# EasyEDA Pro project 哨兵滑环分电板.eprj

# Schematic Schematic1
Board Name: Board1; Create Date: 2026-02-23; Page Name: P1; Project Name: 哨兵滑环分电板; Schematic Name: Schematic1; Update Date: 2026-02-23; Company: 嘉立创EDA; Page Size: A4; Version: V1.0
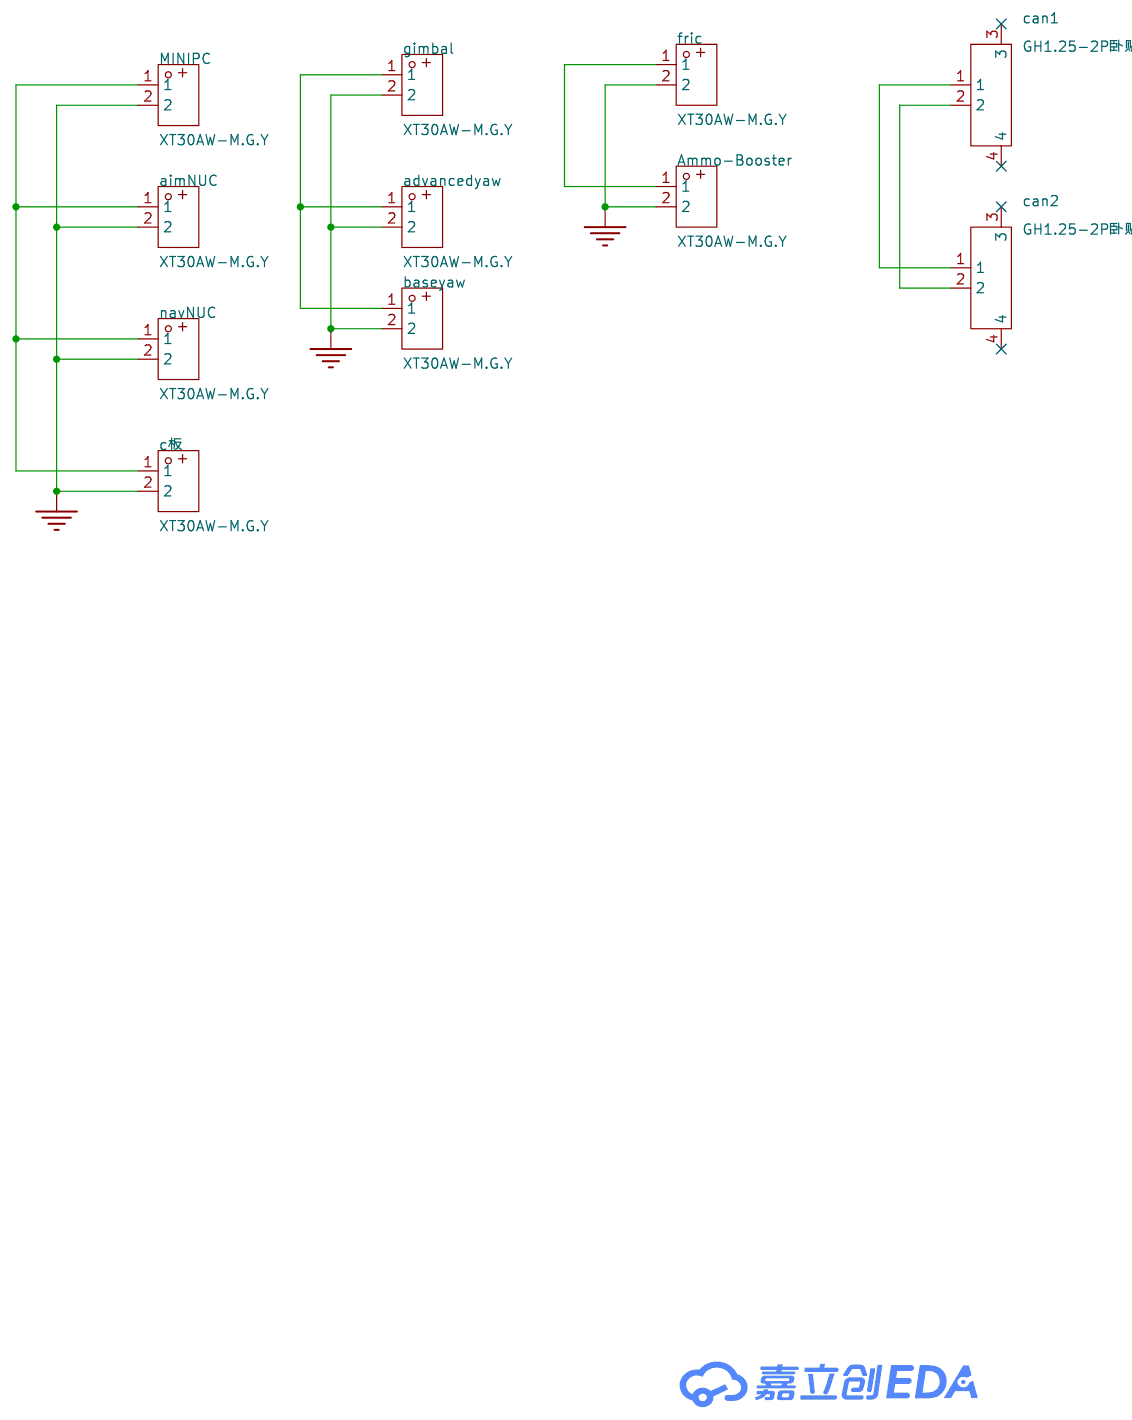
[diagram p0: schematic sheet]

## Parts
advancedyaw  XT30AW-M.G.Y  [CONN-TH_XT30AW-M.G.Y]
aimNUC  XT30AW-M.G.Y  [CONN-TH_XT30AW-M.G.Y]
Ammo-Booster  XT30AW-M.G.Y  [CONN-TH_XT30AW-M.G.Y]
baseyaw  XT30AW-M.G.Y  [CONN-TH_XT30AW-M.G.Y]
can1  GH1.25-2P卧贴  [CONN-SMD_2P-P1.25_X1251WRS-02HF-LPSW]
can2  GH1.25-2P卧贴  [CONN-SMD_2P-P1.25_X1251WRS-02HF-LPSW]
c板  XT30AW-M.G.Y  [CONN-TH_XT30AW-M.G.Y]
fric  XT30AW-M.G.Y  [CONN-TH_XT30AW-M.G.Y]
gimbal  XT30AW-M.G.Y  [CONN-TH_XT30AW-M.G.Y]
MINIPC  XT30AW-M.G.Y  [CONN-TH_XT30AW-M.G.Y]
navNUC  XT30AW-M.G.Y  [CONN-TH_XT30AW-M.G.Y]

## Library data of the parts
advancedyaw aimNUC Ammo-Booster baseyaw c板 fric gimbal MINIPC navNUC = XT30AW-M.G.Y: LCSC Part Name: XT30AW防水锁扣镀金15A二芯公插头; Supplier Part: C19268026; Manufacturer: AMASS(艾迈斯); JLCPCB Part Class: 扩展库; Datasheet: https://item.szlcsc.com/datasheet/XT30AW-M.G.Y/20526037.html; Supplier: LCSC
can1 can2 = GH1.25-2P卧贴_C9900015099: Supplier Part: C9900015099; JLCPCB Part Class: 扩展库; Supplier: LCSC

## Nets
GND: advancedyaw.2 aimNUC.2 Ammo-Booster.2 baseyaw.2 c板.2 fric.2 gimbal.2 MINIPC.2 navNUC.2
$1N339: aimNUC.1 c板.1 MINIPC.1 navNUC.1
$1N534: advancedyaw.1 baseyaw.1 gimbal.1
$1N591: Ammo-Booster.1 fric.1
$1N610: can1.1 can2.1
$1N616: can1.2 can2.2

Not connected (* = marked no-connect by the designer): can1 3* 4*; can2 3* 4*

# Board PCB1
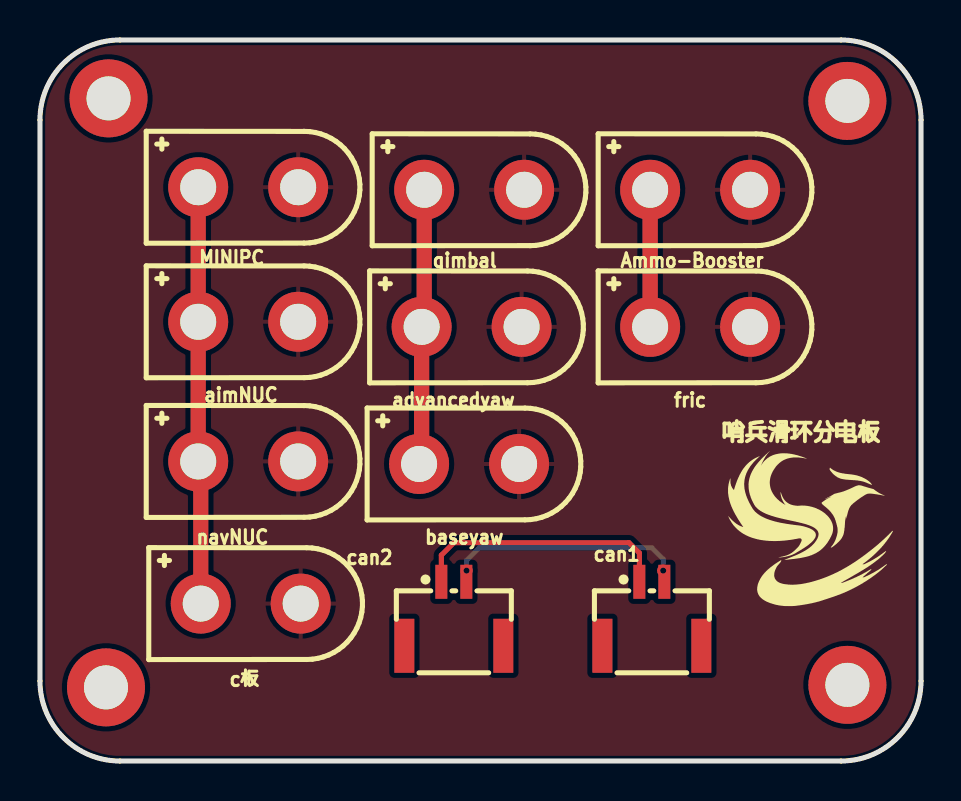
[diagram p1: board, top side]
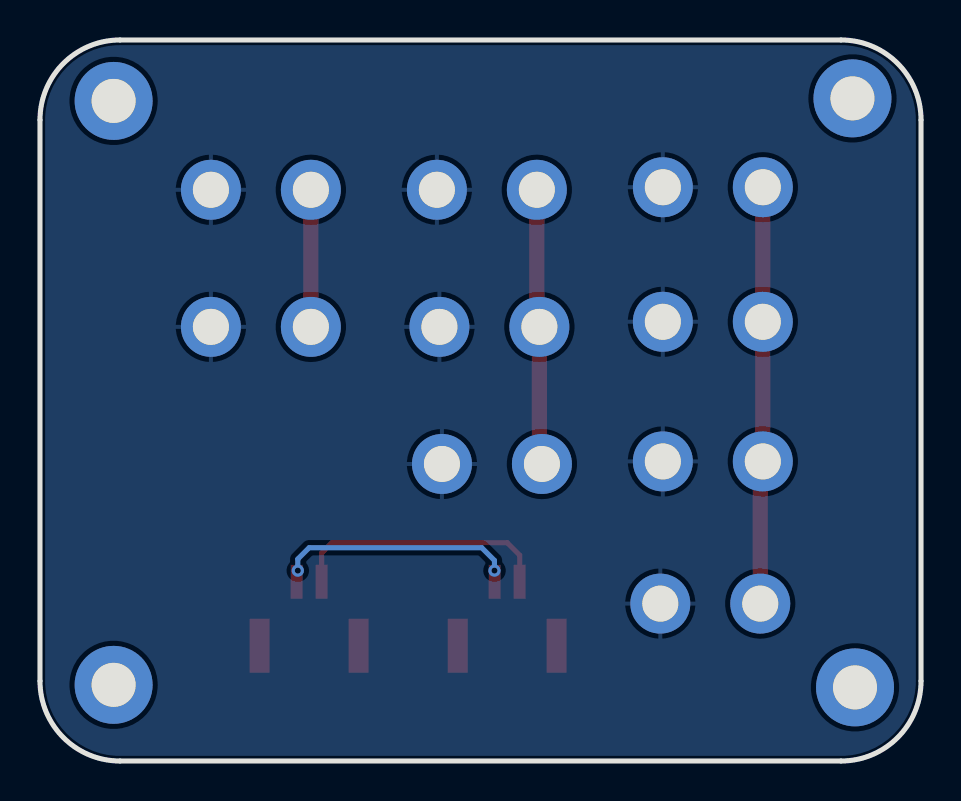
[diagram p2: board, bottom side, seen from below]

Outline 44.07 x 36.07 mm; copper layers: Top Layer, Bottom Layer. Coordinates in mm from the lower left corner of the outline.
Outline path: 0,32.07 0,4 arc(1.17,1.17) 4,0 40.07,0 arc(42.9,1.17) 44.07,4 44.07,32.07 arc(42.9,34.9) 40.07,36.07 4,36.07 arc(1.17,34.9) 0,32.07
Stack: Top Layer 0.035mm / Dielectric1 1.51mm FR4 er 4.5 / Bottom Layer 0.035mm

## Design rules (mm)
template: JLCPCB Capability(Two Layers Board)
spacing copperThickness1oz (default): track to track 0.102, other pairs 0.152 to 0.3
spacing copperThickness2oz: track to track 0.203, other pairs 0.152 to 0.3
track width copperThickness1oz (default): min 0.127, default 0.254, max 2.54
track width copperThickness2oz: min 0.203, default 0.254, max 2.54
differential pair differentialPair (default): width min 0.127, default 0.254, max 2.54; gap min 0.152, default 0.152
via viaSize (default): diameter min 0.5, default 0.61, max 10; hole min 0.3, default 0.305, max 6.3

## Placement (name value [footprint] x y rotation side)
advancedyaw  XT30AW-M.G.Y  [CONN-TH_XT30AW-M.G.Y]  21.59 21.72 0 top
aimNUC  XT30AW-M.G.Y  [CONN-TH_XT30AW-M.G.Y]  10.41 21.97 0 top
Ammo-Booster  XT30AW-M.G.Y  [CONN-TH_XT30AW-M.G.Y]  33.02 28.58 0 top
baseyaw  XT30AW-M.G.Y  [CONN-TH_XT30AW-M.G.Y]  21.46 14.86 0 top
can1  GH1.25-2P卧贴  [CONN-SMD_2P-P1.25_X1251WRS-02HF-LPSW]  30.61 7.37 0 top
can2  GH1.25-2P卧贴  [CONN-SMD_2P-P1.25_X1251WRS-02HF-LPSW]  20.7 7.37 0 top
c板  XT30AW-M.G.Y  [CONN-TH_XT30AW-M.G.Y]  10.54 7.87 0 top
fric  XT30AW-M.G.Y  [CONN-TH_XT30AW-M.G.Y]  33.02 21.72 0 top
gimbal  XT30AW-M.G.Y  [CONN-TH_XT30AW-M.G.Y]  21.72 28.58 0 top
MINIPC  XT30AW-M.G.Y  [CONN-TH_XT30AW-M.G.Y]  10.41 28.7 0 top
navNUC  XT30AW-M.G.Y  [CONN-TH_XT30AW-M.G.Y]  10.41 14.99 0 top
NOREF  -  [Pad_e259]  3.43 33.15 0 top
NOREF#2  -  [Pad_e261]  3.3 3.68 0 top
NOREF#3  -  [Pad_e260]  40.39 33.02 0 top
NOREF#4  -  [Pad_e262]  40.39 3.81 0 top

## Footprints (pads in the part's own frame, mm; a bottom-side part is the same pattern mirrored in y, then rotated)
CONN-SMD_2P-P1.25_X1251WRS-02HF-LPSW
  rect 0.6x1.7 smd: 1(-0.625,1.6) 2(0.625,1.6)
  rect 1x2.7 smd: 3(2.475,-1.6) 4(-2.475,-1.6)
CONN-TH_XT30AW-M.G.Y
  round 3 hole 1.8: 1(-2.5,0) 2(2.5,0)
Pad_e259
  round 3.9 hole 2.2: 1(0,0)
Pad_e260
  round 3.9 hole 2.2: 2(0,0)
Pad_e261
  round 3.9 hole 2.2: 3(0,0)
Pad_e262
  round 3.9 hole 2.2: 4(0,0)

## Nets
As in the schematic.

Pads without a net: can1 3 4; can2 3 4; NOREF 1; NOREF#2 3; NOREF#3 2; NOREF#4 4

## Via types
v1: diameter 0.61, hole 0.305, Top Layer to Bottom Layer, 2 vias

## Routing (per net, layer and track width the routed paths; a pad name or vN(x,y) marks a point on that pad's centre or on a via; arc(x,y) is an arc through that point)
$1N339: length 20.9
  Top Layer w0.762: c板.1 8.04,14.86 navNUC.1 aimNUC.1 MINIPC.1
$1N534: length 13.8
  Top Layer w0.762: gimbal.1 19.22,21.84 advancedyaw.1 19.09,14.99 baseyaw.1
$1N591: length 6.2
  Top Layer w0.762: 30.52,27.94 fric.1
$1N610: length 13.1
  Top Layer w0.254: 29.98,8.97 29.98,10.4 29.46,10.92 20.7,10.92 20.08,10.3 20.08,8.97
$1N616: length 11.4
  Bottom Layer w0.254: v1(31.17,9.53) 31.17,10.1 30.61,10.67 21.97,10.67 21.34,10.03 v1(21.34,9.53)

## Copper pours and planes (outline as drawn; the poured copper is in the pictures)
GND on Top Layer: -3.56,41.78 54.1,41.78 54.1,-2.54 -3.56,-2.54
GND on Bottom Layer: -4.32,41.4 47.37,41.4 47.37,-1.52 -4.32,-1.52

## Text on the board
Top Silkscreen Layer: 哨兵滑环分电板
